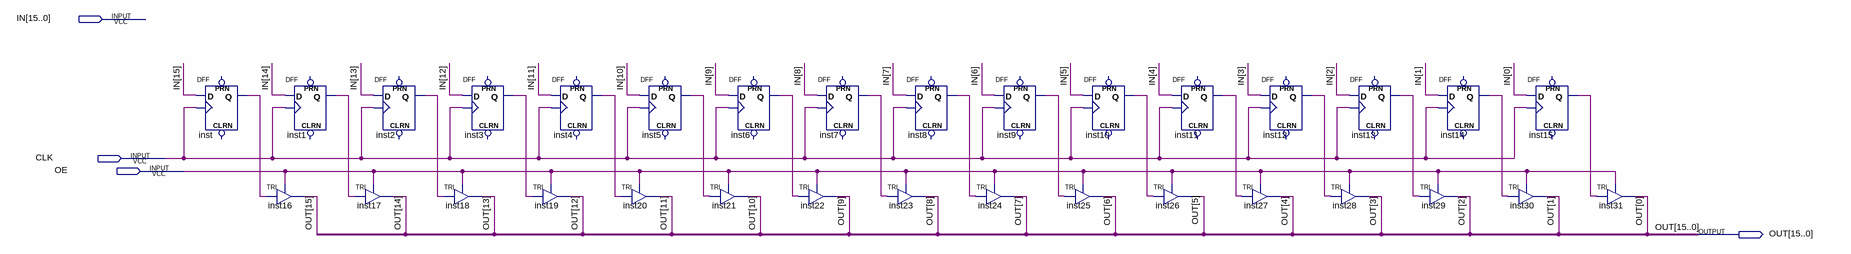
[diagram p0: schematic sheet]
// Quartus schematic REGISTER_16Bit.bdf as structural Verilog: 32 symbols, 4 pins
module REGISTER_16Bit (
  input  [15:0] IN,
  input  CLK,
  input  OE,
  output [15:0] OUT
);

  wire inst1_q, inst2_q, inst3_q, inst4_q, inst5_q, inst6_q, inst7_q, inst8_q, inst9_q, inst10_q, inst11_q,
       inst12_q, inst13_q, inst14_q, inst15_q, inst_q;

  DFF inst (.CLK(CLK), .D(IN[15]), .Q(inst_q));  // open: CLRN, PRN
  TRI inst16 (.IN(inst_q), .OE(OE), .OUT(OUT[15]));
  DFF inst1 (.CLK(CLK), .D(IN[14]), .Q(inst1_q));  // open: CLRN, PRN
  DFF inst2 (.CLK(CLK), .D(IN[13]), .Q(inst2_q));  // open: CLRN, PRN
  TRI inst17 (.IN(inst1_q), .OE(OE), .OUT(OUT[14]));
  DFF inst3 (.CLK(CLK), .D(IN[12]), .Q(inst3_q));  // open: CLRN, PRN
  TRI inst18 (.IN(inst2_q), .OE(OE), .OUT(OUT[13]));
  DFF inst4 (.CLK(CLK), .D(IN[11]), .Q(inst4_q));  // open: CLRN, PRN
  TRI inst19 (.IN(inst3_q), .OE(OE), .OUT(OUT[12]));
  TRI inst20 (.IN(inst4_q), .OE(OE), .OUT(OUT[11]));
  DFF inst5 (.CLK(CLK), .D(IN[10]), .Q(inst5_q));  // open: CLRN, PRN
  DFF inst6 (.CLK(CLK), .D(IN[9]), .Q(inst6_q));  // open: CLRN, PRN
  TRI inst21 (.IN(inst5_q), .OE(OE), .OUT(OUT[10]));
  DFF inst7 (.CLK(CLK), .D(IN[8]), .Q(inst7_q));  // open: CLRN, PRN
  TRI inst22 (.IN(inst6_q), .OE(OE), .OUT(OUT[9]));
  DFF inst8 (.CLK(CLK), .D(IN[7]), .Q(inst8_q));  // open: CLRN, PRN
  TRI inst23 (.IN(inst7_q), .OE(OE), .OUT(OUT[8]));
  TRI inst24 (.IN(inst8_q), .OE(OE), .OUT(OUT[7]));
  DFF inst9 (.CLK(CLK), .D(IN[6]), .Q(inst9_q));  // open: CLRN, PRN
  DFF inst10 (.CLK(CLK), .D(IN[5]), .Q(inst10_q));  // open: CLRN, PRN
  TRI inst25 (.IN(inst9_q), .OE(OE), .OUT(OUT[6]));
  DFF inst11 (.CLK(CLK), .D(IN[4]), .Q(inst11_q));  // open: CLRN, PRN
  TRI inst26 (.IN(inst10_q), .OE(OE), .OUT(OUT[5]));
  DFF inst12 (.CLK(CLK), .D(IN[3]), .Q(inst12_q));  // open: CLRN, PRN
  TRI inst27 (.IN(inst11_q), .OE(OE), .OUT(OUT[4]));
  TRI inst28 (.IN(inst12_q), .OE(OE), .OUT(OUT[3]));
  DFF inst13 (.CLK(CLK), .D(IN[2]), .Q(inst13_q));  // open: CLRN, PRN
  DFF inst14 (.CLK(CLK), .D(IN[1]), .Q(inst14_q));  // open: CLRN, PRN
  TRI inst29 (.IN(inst13_q), .OE(OE), .OUT(OUT[2]));
  DFF inst15 (.CLK(CLK), .D(IN[0]), .Q(inst15_q));  // open: CLRN, PRN
  TRI inst30 (.IN(inst14_q), .OE(OE), .OUT(OUT[1]));
  TRI inst31 (.IN(inst15_q), .OE(OE), .OUT(OUT[0]));
endmodule
